# Altium schematic sheet MEMORY.SchDoc
size A4
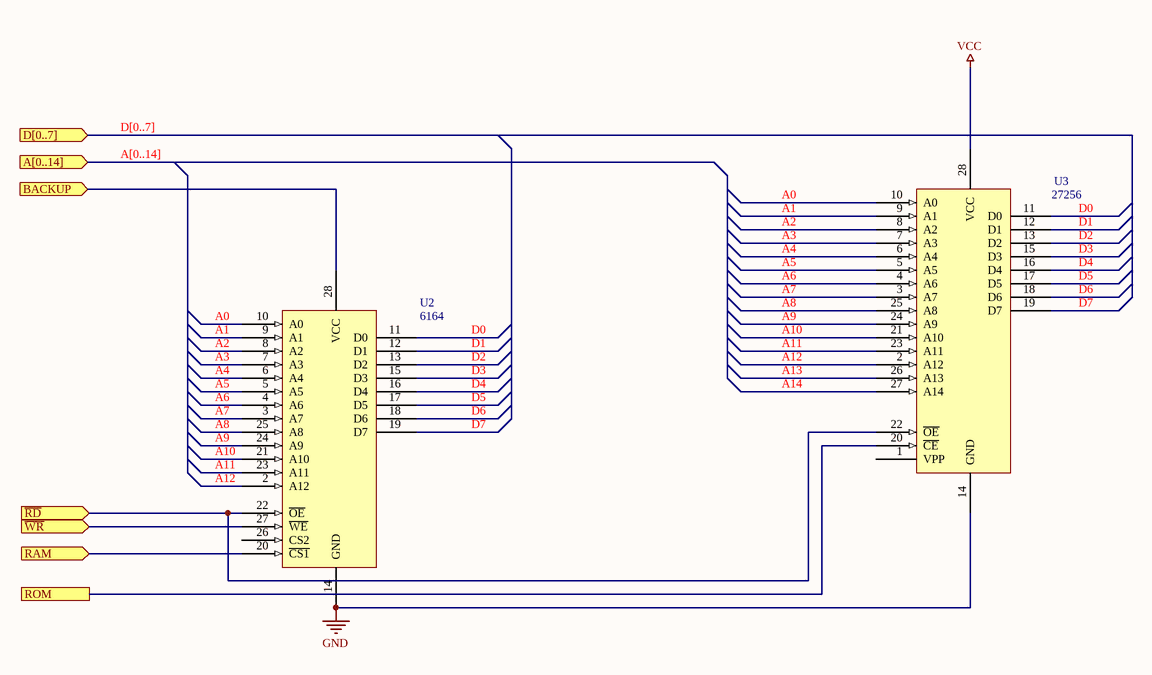
[diagram p0: MEMORY.SchDoc]

## Parts
U2  6164  [DIP28]
U3  27256  [DIP28]

## Ports
A[0..14] (in), BACKUP (in), D[0..7] (in), RAM (in), ROM, ~{RD} (in), ~{WR} (in)

## Nets
GND: U2.14(GND) U3.14(GND)
VCC: U3.28(VCC)
BACKUP: U2.28(VCC) ; port BACKUP
~{RD}: U2.22(~{OE}) U3.22(~{OE}) ; port ~{RD}
RAM: U2.20(~{CS1}) ; port RAM
ROM: U3.20(~{CE}) ; port ROM
~{WR}: U2.27(~{WE}) ; port ~{WR}

Not connected (* = marked no-connect by the designer): U2 2(A12) 3(A7) 4(A6) 5(A5) 6(A4) 7(A3) 8(A2) 9(A1) 10(A0) 11(D0) 12(D1) 13(D2) 15(D3) 16(D4) 17(D5) 18(D6) 19(D7) 21(A10) 23(A11) 24(A9) 25(A8) 26(CS2); U3 1(VPP) 2(A12) 3(A7) 4(A6) 5(A5) 6(A4) 7(A3) 8(A2) 9(A1) 10(A0) 11(D0) 12(D1) 13(D2) 15(D3) 16(D4) 17(D5) 18(D6) 19(D7) 21(A10) 23(A11) 24(A9) 25(A8) 26(A13) 27(A14)

## Notes on the sheet
- D[0..7]
- A[0..14]
- A0
- A1
- A2
- D0
- D1
- A3
- A4
- A5
- A6
- A7
- D2
- D3
- D4
- D5
- D6
- A8
- A9
- A10
- A11
- A12
- D7
- A13
- A14
- (near U2) A10
- (near U2) A11
- (near U2) A12